# EasyEDA Pro project Pros_touch_weight_sensor-v1.0.0-2023-4-8.eprj, board PWS2
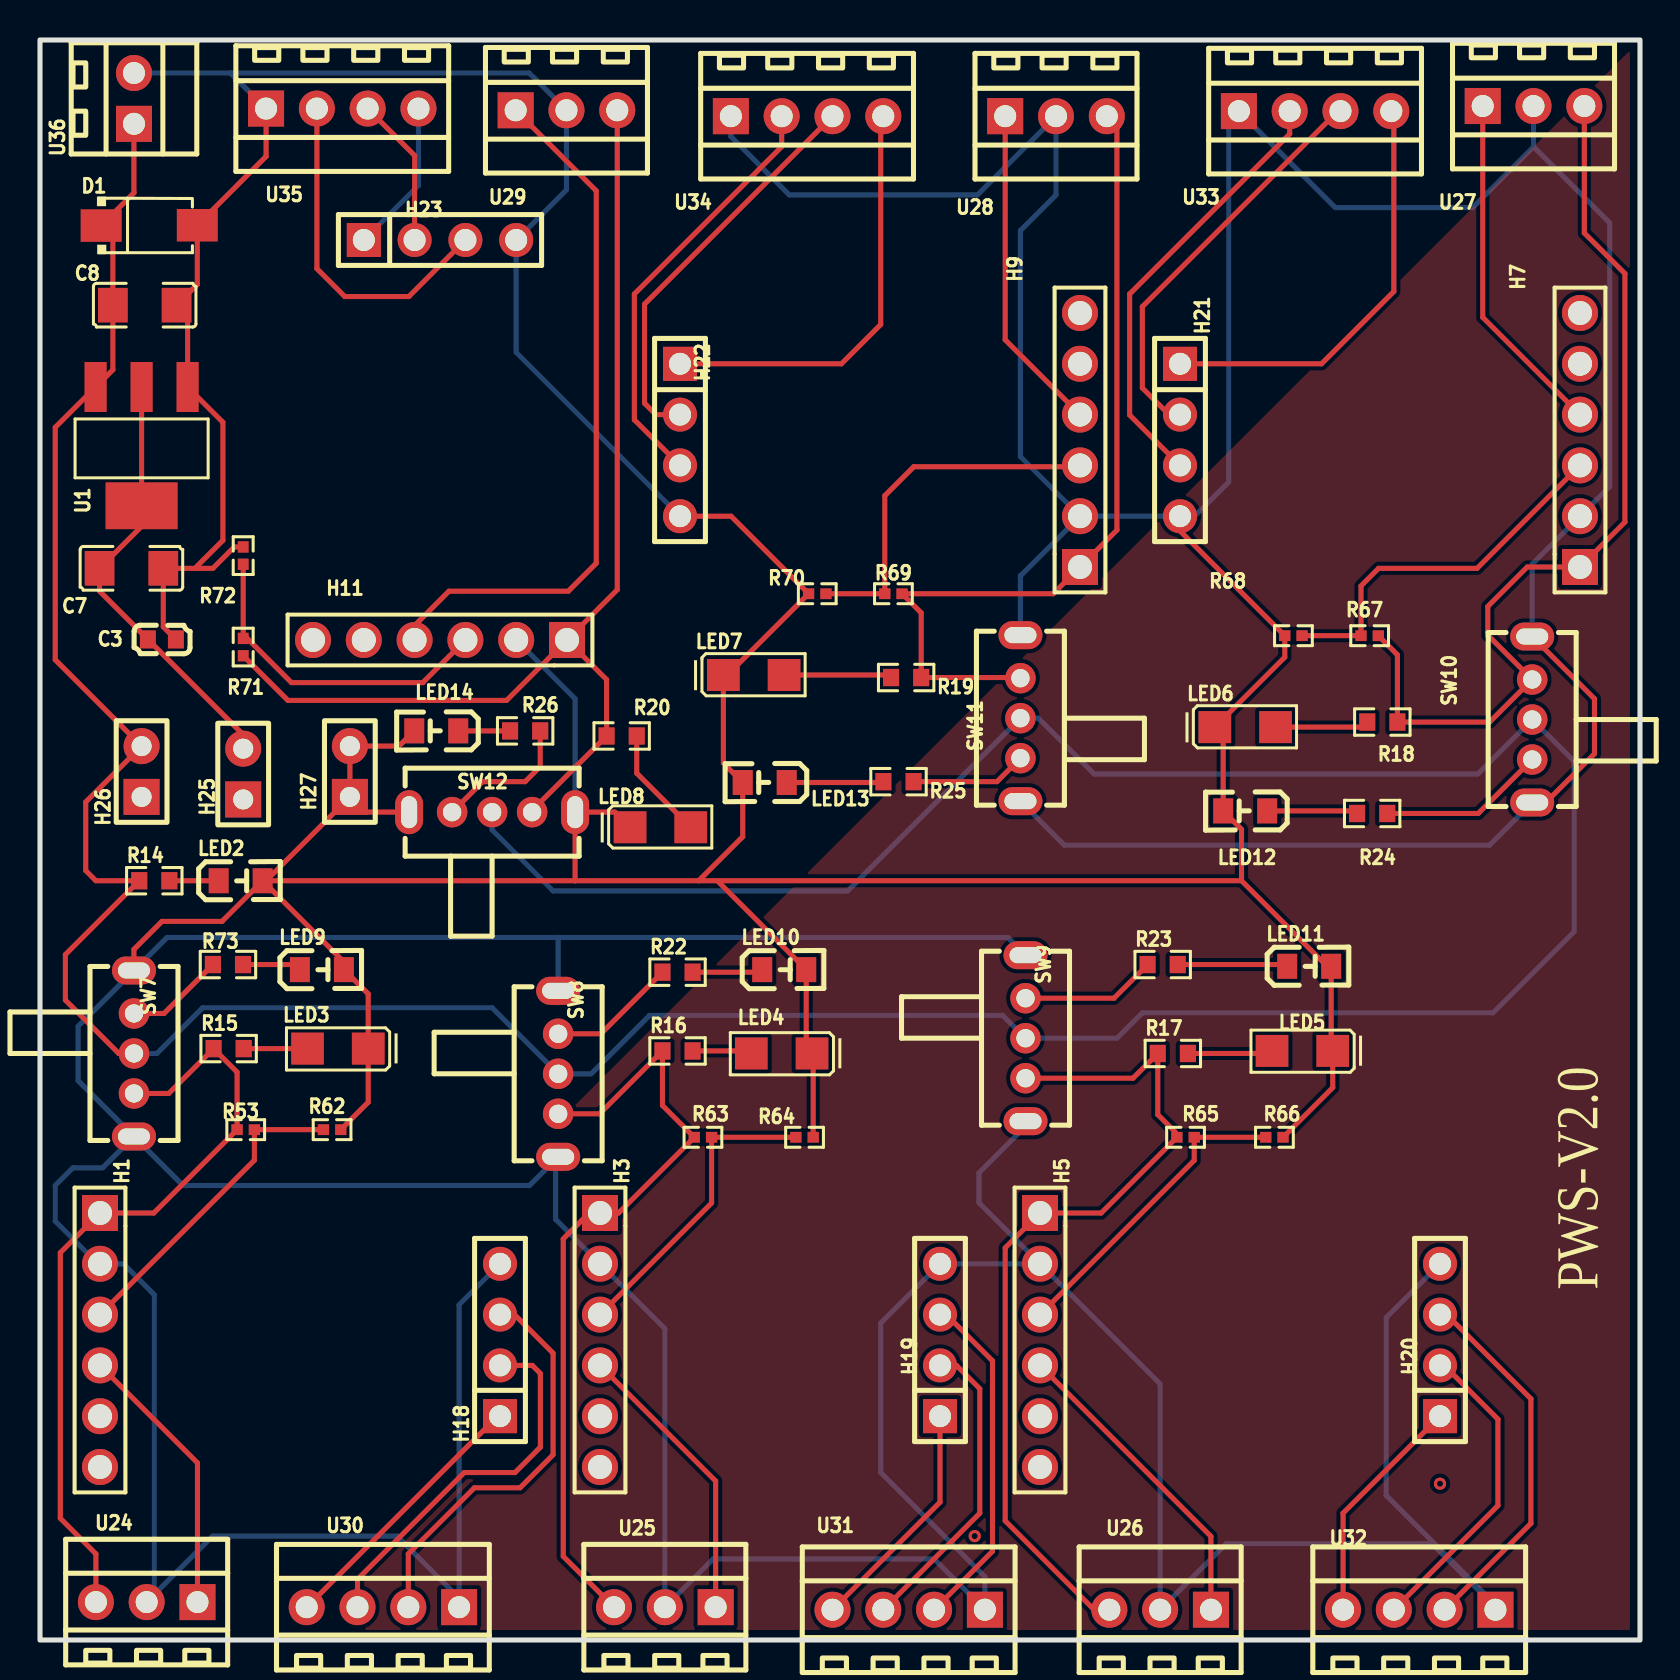
[diagram p5: board, top side]
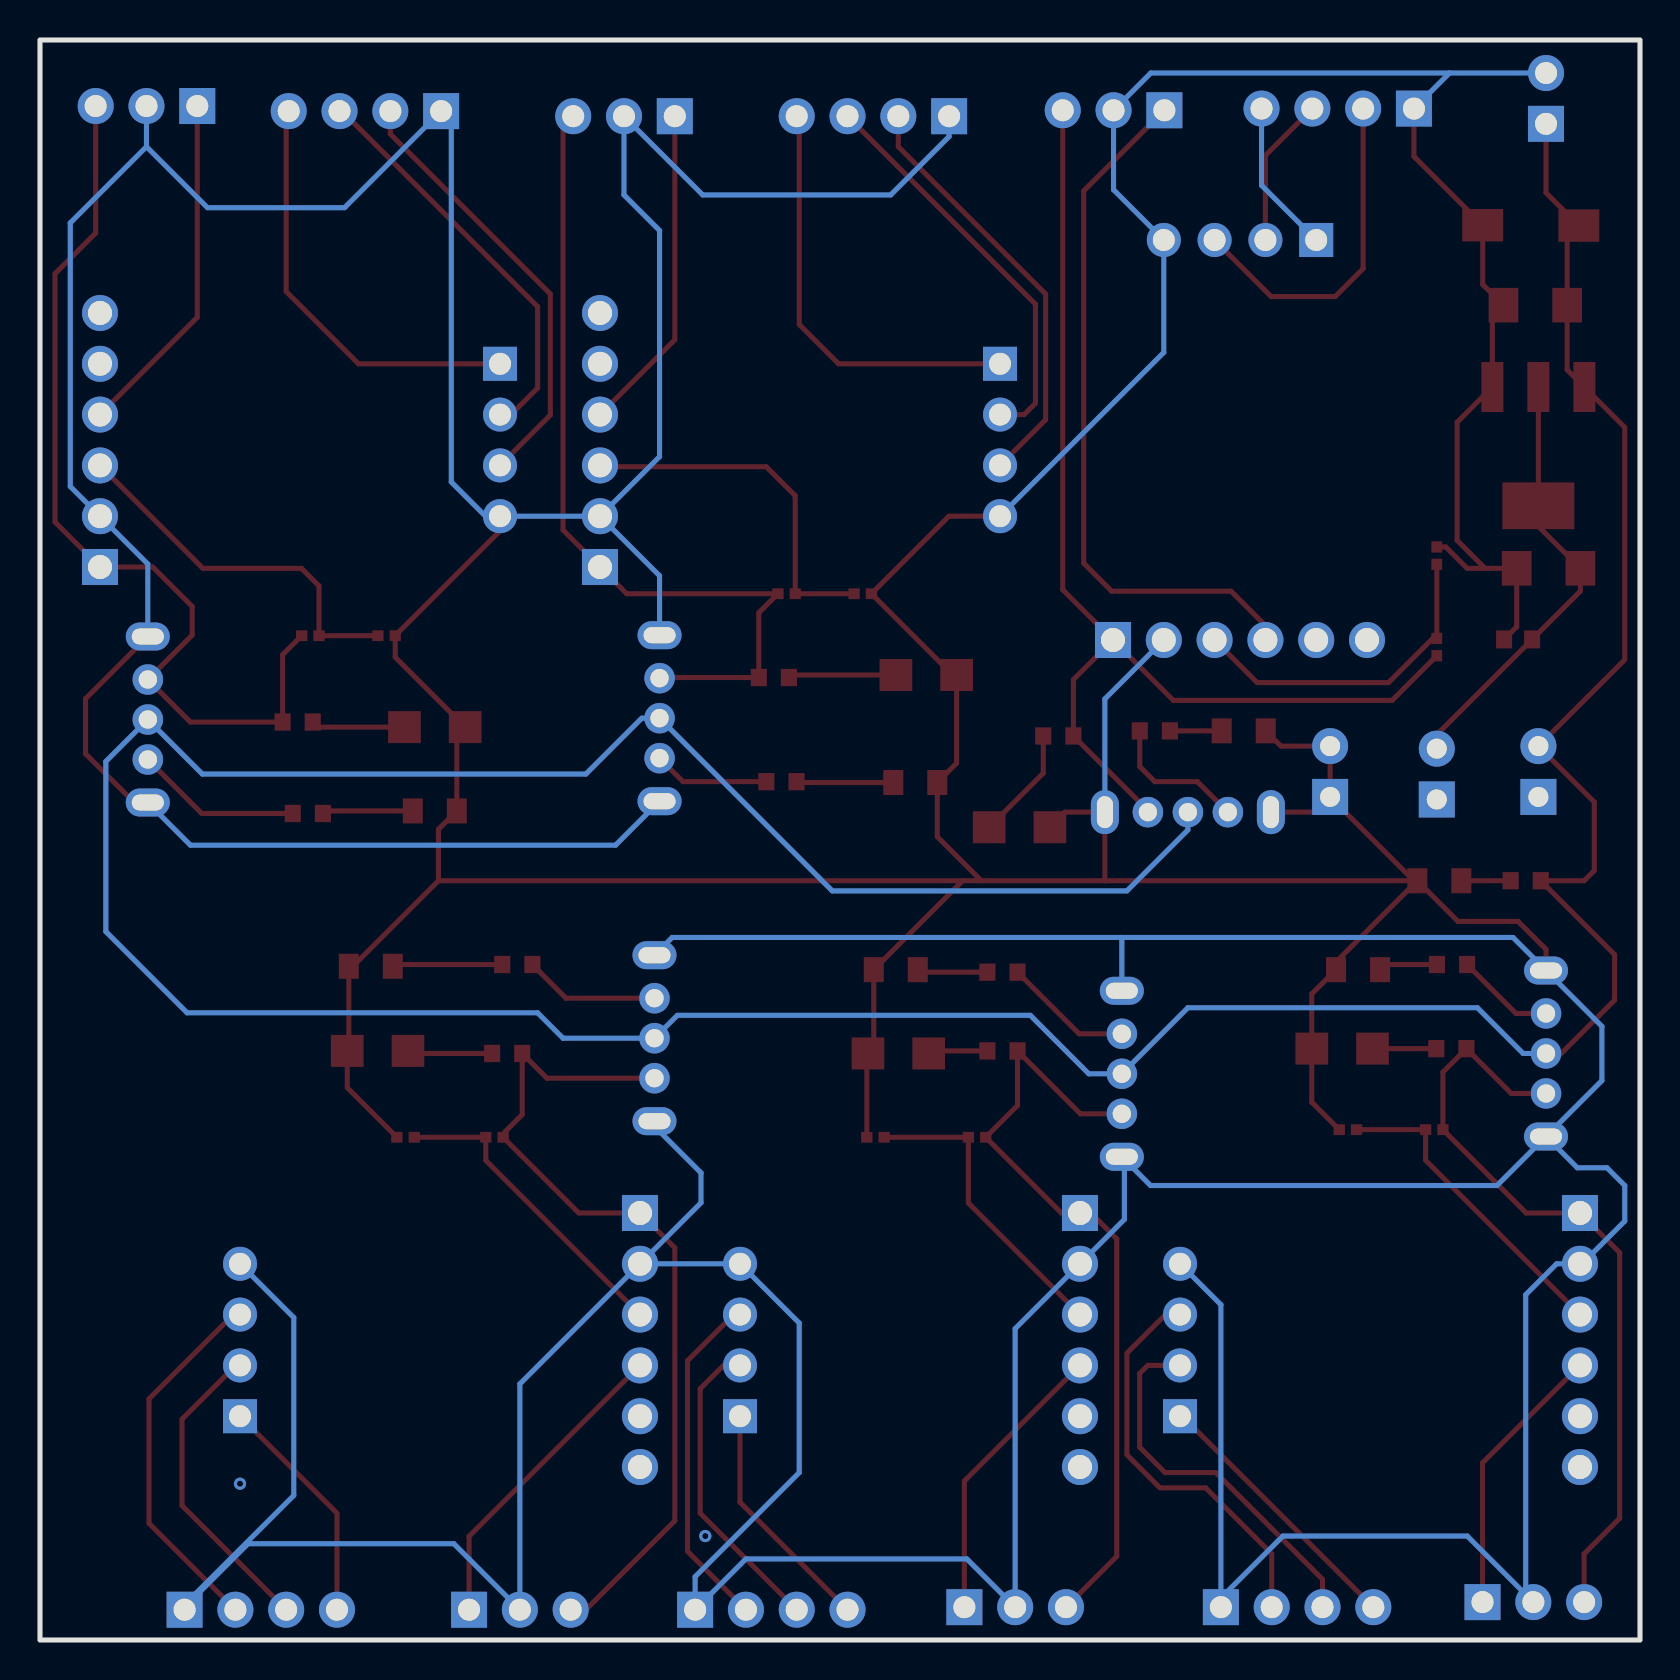
[diagram p6: board, bottom side, seen from below]

Outline 80 x 80 mm; copper layers: Top Layer, Bottom Layer. Coordinates in mm from the lower left corner of the outline.
Outline path: rectangle 0,80 80,0
Stack: Top Layer 0.035mm / Dielectric1 1.51mm FR4 er 4.5 / Bottom Layer 0.035mm

## Design rules (mm)
template: JLCPCB Capability(Two Layers Board)
spacing copperThickness1oz (default): track to track 0.102, other pairs 0.152 to 0.3
spacing copperThickness2oz: track to track 0.203, other pairs 0.152 to 0.3
track width copperThickness1oz (default): min 0.127, default 0.254, max 2.54
track width copperThickness2oz: min 0.203, default 0.254, max 2.54
differential pair differentialPair (default): width min 0.127, default 0.254, max 2.54; gap min 0.152, default 0.152
via viaSize (default): diameter min 0.5, default 0.61, max 10; hole min 0.3, default 0.305, max 6.3

## Placement (name value [footprint] x y rotation side)
C3  100nF  [C0603]  6.1 50.03 180 top
C7  GRM31CC80J476KE01L  [C1206]  4.57 53.58 180 top
C8  GRM31CC80J476KE01L  [C1206]  5.23 66.74 180 top
D1  SMAJ5.0A  [SMA_L4.3-W2.6-LS5.0-RD]  5.46 70.73 0 top
H1  2.54-1x6P直针  [HDR-TH_6P-P2.54-V-M-1]  3 15 270 top
H3  2.54-1x6P直针  [HDR-TH_6P-P2.54-V-M-1]  28 15 270 top
H5  2.54-1x6P直针  [HDR-TH_6P-P2.54-V-M-1]  50 15 270 top
H7  2.54-1x6P直针  [HDR-TH_6P-P2.54-V-M-1]  77 60 90 top
H9  2.54-1x6P直针  [HDR-TH_6P-P2.54-V-M-1]  52 60 90 top
H11  2.54-1x6P直针  [HDR-TH_6P-P2.54-V-M-1]  20 50 180 top
H18  PZ254V-11-04P  [HDR-TH_4P-P2.54-V-M]  23 15 90 top
H19  PZ254V-11-04P  [HDR-TH_4P-P2.54-V-M]  45 15 90 top
H20  PZ254V-11-04P  [HDR-TH_4P-P2.54-V-M]  70 15 90 top
H21  PZ254V-11-04P  [HDR-TH_4P-P2.54-V-M]  57 60 270 top
H22  PZ254V-11-04P  [HDR-TH_4P-P2.54-V-M]  32 60 270 top
H23  PZ254V-11-04P  [HDR-TH_4P-P2.54-V-M]  20 70 0 top
H25  B-2100S02P-A110  [HDR-TH_2P-P2.54-V-M-1]  10.16 43.3 90 top
H26  B-2100S02P-A110  [HDR-TH_2P-P2.54-V-M-1]  5.08 43.42 90 top
H27  B-2100S02P-A110  [HDR-TH_2P-P2.54-V-M-1]  15.49 43.42 90 top
LED2  NCD0805B2  [LED0805-RD]  10.03 37.96 0 top
LED3  NCD1206G1  [LED1206-RD]  14.89 29.57 180 top
LED4  NCD1206G1  [LED1206-RD]  37.08 29.33 180 top
LED5  NCD1206G1  [LED1206-RD]  63.12 29.45 180 top
LED6  NCD1206G1  [LED1206-RD]  60.26 45.64 0 top
LED7  NCD1206G1  [LED1206-RD]  35.69 48.25 0 top
LED8  NCD1206G1  [LED1206-RD]  31.02 40.64 0 top
LED9  NCD0805B2  [LED0805-RD]  14.1 33.52 0 top
LED10  NCD0805B2  [LED0805-RD]  37.21 33.52 0 top
LED11  NCD0805B2  [LED0805-RD]  63.46 33.69 0 top
LED12  NCD0805B2  [LED0805-RD]  60.26 41.45 180 top
LED13  NCD0805B2  [LED0805-RD]  36.24 42.88 180 top
LED14  NCD0805B2  [LED0805-RD]  19.81 45.46 180 top
R14  1kΩ  [R0603]  5.72 37.96 0 top
R15  1kΩ  [R0603]  9.43 29.57 0 top
R16  1kΩ  [R0603]  31.88 29.45 0 top
R17  1kΩ  [R0603]  56.64 29.33 0 top
R18  1kΩ  [R0603]  67.12 45.9 180 top
R19  1kΩ  [R0603]  43.31 48.12 180 top
R20  1kΩ  [R0603]  29.08 45.2 0 top
R22  1kΩ  [R0603]  31.88 33.39 0 top
R23  1kΩ  [R0603]  56.13 33.77 0 top
R24  1kΩ  [R0603]  66.61 41.33 180 top
R25  1kΩ  [R0603]  42.93 42.92 180 top
R26  1kΩ  [R0603]  24.26 45.46 180 top
R53  1kΩ  [R0402]  10.29 25.52 0 top
R62  1kΩ  [R0402]  14.61 25.52 180 top
R63  1kΩ  [R0402]  33.15 25.14 180 top
R64  1kΩ  [R0402]  38.23 25.14 180 top
R65  1kΩ  [R0402]  57.28 25.14 180 top
R66  1kΩ  [R0402]  61.72 25.14 180 top
R67  1kΩ  [R0402]  66.48 50.22 0 top
R68  1kΩ  [R0402]  62.67 50.22 0 top
R69  1kΩ  [R0402]  42.67 52.31 0 top
R70  1kΩ  [R0402]  38.86 52.31 0 top
R71  1kΩ  [R0402]  10.16 49.65 270 top
R72  1kΩ  [R0402]  10.16 54.22 270 top
R73  1kΩ  [R0603]  9.4 33.77 0 top
SW7  SK12D07VG4  [SW-TH_SK12D07VG4]  4.7 29.33 270 top
SW8  SK12D07VG4  [SW-TH_SK12D07VG4]  25.91 28.31 270 top
SW9  SK12D07VG4  [SW-TH_SK12D07VG4]  49.28 30.09 270 top
SW10  SK12D07VG4  [SW-TH_SK12D07VG4]  74.61 46.02 90 top
SW11  SK12D07VG4  [SW-TH_SK12D07VG4]  49.02 46.09 90 top
SW12  SK12D07VG4  [SW-TH_SK12D07VG4]  22.61 41.39 0 top
U1  AMS1117-3.3  [SOT-223-3_L6.5-W3.4-P2.30-LS7.0-BR]  5.08 59.68 90 top
U24  DB125-2.54-3P-GN-S  [CONN-TH_DB125-2.54-3P-GN]  5.33 1.9 180 top
U25  DB125-2.54-3P-GN-S  [CONN-TH_DB125-2.54-3P-GN]  31.24 1.64 180 top
U26  DB125-2.54-3P-GN-S  [CONN-TH_DB125-2.54-3P-GN]  56.01 1.51 180 top
U27  DB125-2.54-3P-GN-S  [CONN-TH_DB125-2.54-3P-GN]  74.68 76.7 0 top
U28  DB125-2.54-3P-GN-S  [CONN-TH_DB125-2.54-3P-GN]  50.8 76.19 0 top
U29  DB125-2.54-3P-GN-S  [CONN-TH_DB125-2.54-3P-GN]  26.32 76.49 0 top
U30  DB125-2.54-4P-GN-S  [CONN-TH_DB125-2.54-4P-GN]  17.14 1.64 180 top
U31  DB125-2.54-4P-GN-S  [CONN-TH_DB125-2.54-4P-GN]  43.43 1.51 180 top
U32  DB125-2.54-4P-GN-S  [CONN-TH_DB125-2.54-4P-GN]  68.96 1.51 180 top
U33  DB125-2.54-4P-GN-S  [CONN-TH_DB125-2.54-4P-GN]  63.75 76.44 0 top
U34  DB125-2.54-4P-GN-S  [CONN-TH_DB125-2.54-4P-GN]  38.35 76.19 0 top
U35  DB125-2.54-4P-GN-S  [CONN-TH_DB125-2.54-4P-GN]  15.11 76.57 0 top
U36  DB125-2.54-2P-GN-S  [CONN-TH_DB125-2.54-2P-GN]  4.7 77.08 90 top

## Footprints (pads in the part's own frame, mm; a bottom-side part is the same pattern mirrored in y, then rotated)
C0603
  rect 0.8x0.9 smd: 1(-0.7,0) 2(0.7,0)
C1206
  rect 1.485x1.728 smd: 1(-1.593,0) 2(1.593,0)
CONN-TH_DB125-2.54-2P-GN
  rect 1.8x1.8 hole 1.1: 1(-1.27,0)
  round 1.8 hole 1.1: 2(1.27,0)
CONN-TH_DB125-2.54-3P-GN
  rect 1.8x1.8 hole 1.1: 1(-2.54,0)
  round 1.8 hole 1.1: 2(0,0) 3(2.54,0)
CONN-TH_DB125-2.54-4P-GN
  rect 1.8x1.8 hole 1.1: 1(-3.81,0)
  round 1.8 hole 1.1: 2(-1.27,0) 3(1.27,0) 4(3.81,0)
HDR-TH_2P-P2.54-V-M-1
  rect 1.8x1.8 hole 1: 1(-1.27,0)
  round 1.8 hole 1: 2(1.27,0)
HDR-TH_4P-P2.54-V-M
  rect 1.7x1.7 hole 1.1: 1(-3.81,0)
  round 1.7 hole 1.1: 2(-1.27,0) 3(1.27,0) 4(3.81,0)
HDR-TH_6P-P2.54-V-M-1
  rect 1.8x1.8 hole 1.2: 1(-6.35,0)
  round 1.8 hole 1.2: 2(-3.81,0) 3(-1.27,0) 4(1.27,0) 5(3.81,0) 6(6.35,0)
LED0805-RD
  rect 1x1.25 smd: 1(-1.1,0) 2(1.1,0)
LED1206-RD
  rect 1.635x1.6 smd: 1(-1.518,0) 2(1.518,0)
R0402
  rect 0.566x0.54 smd: 1(-0.433,0) 2(0.433,0)
R0603
  rect 0.806x0.864 smd: 1(-0.753,0) 2(0.753,0)
SMA_L4.3-W2.6-LS5.0-RD
  rect 2.046x1.62 smd: 1(-2.404,-0.009) 2(2.404,0.009)
SOT-223-3_L6.5-W3.4-P2.30-LS7.0-BR
  rect 2.5x1.1 smd: 1(2.97,-2.3) 2(2.97,0) 3(2.97,2.3)
  rect 2.34x3.6 smd: 4(-2.97,0)
SW-TH_SK12D07VG4
  round 1.524 hole 0.914: 1(-2,0) 2(0,0) 3(2,0)
  oval 1.4x2.2 hole 0.8x1.6: 4(4.15,0) 5(-4.15,0)

## Nets
As in the schematic.

Pads without a net: H1 5 6; H3 5 6; H5 5 6; H7 5 6; H9 5 6; H11 5 6; H25 1; H26 1

## Via types
v1: diameter 0.61, hole 0.305, Top Layer to Bottom Layer, 2 vias

## Routing (per net, layer and track width the routed paths; a pad name or vN(x,y) marks a point on that pad's centre or on a via; arc(x,y) is an arc through that point)
3.3V: length 21.9
  Top Layer w0.254: H25.2 10.16,45.26 C3.2 2.98,52.44 C7.2 5.08,55.68 U1.4 U1.2
5V: length 207
  Top Layer w0.254: U36.1 4.7,72.36 D1.1 3.64,70.13 C8.2 3.64,63.51 U1.3 0.76,60.63 0.76,49.01 H26.2 2.29,41.9 2.29,38.47 2.79,37.96 R14.1 1.27,34.27 1.27,31.99 3.94,29.33 SW7.2
  Bottom Layer w0.254: SW7.2 5.84,29.33 8.13,31.61 22.61,31.61 SW8.2 27.56,28.31 30.48,31.23 48.13,31.23 SW9.2 53.85,30.09 55.12,31.36 72.64,31.36 76.71,35.42 76.71,43.93 SW10.2 71.88,43.3 52.71,43.3 49.91,46.09 SW11.2 40.39,37.45 25.65,37.45 22.61,40.5 SW12.2
GND: length 713.5
  Top Layer w0.254: SW7.5 4.7,34.53 6.1,35.93 9.1,35.93 LED2.2 ; SW10.4 77.72,47.06 77.72,44.31 75.29,41.87 SW10.5 ; 7.75,53.58 C7.1 6.16,50.66 C3.1 ; 7.75,53.58 9.14,54.98 9.14,60.89 U1.1 7.38,66.19 C8.1 7.86,67.78 D1.2 11.3,74.18 U35.1 ; 7.75,53.58 8.64,53.58 9.71,54.65 R72.1 ; H21.4 57,55.45 R68.1 62.24,49.14 LED6.1 59.16,45.23 LED12.2 60.08,40.53 60.08,37.96 ; 32.93,37.96 33.87,37.96 ; 32.93,37.96 35.14,40.17 LED13.2 34.17,43.84 LED7.1 34.37,48.25 R70.1 34.55,56.19 H22.4 ; 32.93,37.96 26.76,37.96 ; 33.87,37.96 60.08,37.96 ; 33.87,37.96 LED10.2 38.31,29.62 LED4.1 38.66,29.27 R64.1 ; H27.1 11.3,37.96 ; H27.1 16.26,41.39 SW12.5 ; H27.1 H27.2 17.95,44.69 LED14.2 ; 11.3,37.96 26.76,37.96 ; 11.3,37.96 LED2.2 ; 60.08,37.96 64.35,33.69 LED11.2 64.56,29.53 LED5.1 64.64,27.62 R66.1 ; LED8.1 28.75,41.39 SW12.4 26.76,37.97 26.76,37.96 ; LED2.2 15.2,33.9 LED9.2 16.41,32.3 LED3.1 16.41,26.89 R62.1
  Bottom Layer w0.254: 25.94,35.13 6.35,35.13 SW7.5 1.91,30.68 1.91,27.97 SW7.4 ; 25.94,35.13 48.39,35.13 SW9.5 ; 25.94,35.13 25.91,35.1 25.91,32.46 ; H9.2 H21.4 57.72,56.19 59.44,57.9 59.44,75.94 U33.1 64.77,71.62 71.63,71.62 74.68,74.67 ; H9.2 49.02,53.21 SW11.4 ; H9.2 49.02,59.17 49.02,70.47 50.8,72.25 U28.2 46.86,72.25 37.47,72.25 34.54,75.17 U34.1 ; SW10.4 74.61,53.8 H7.2 78.49,57.68 78.49,70.86 74.68,74.67 ; SW10.5 72.48,39.74 51.22,39.74 SW11.5 ; 20.96,2.1 20.96,1.64 ; 20.96,2.1 17.85,5.2 8.64,5.2 5.72,2.28 ; 20.96,2.1 20.96,16.76 H18.4 ; 72.77,1.64 U32.1 ; 72.77,1.64 72.77,1.77 67.31,7.23 67.31,16.12 H20.4 ; 72.77,1.64 69.6,4.82 59.31,4.82 U26.2 56.01,12.8 H5.2 ; 25.78,24.03 25.78,21.03 H3.2 31.24,15.57 U25.2 33.66,4.05 44.7,4.05 U31.1 47.24,3.16 42.04,8.37 42.04,15.85 H19.4 H5.2 ; 25.78,24.03 SW8.4 ; 25.78,24.03 24.47,22.72 7.15,22.72 SW7.4 ; H5.2 46.95,21.86 46.95,23.36 49.15,25.56 ; SW12.4 26.76,47.05 H11.2 ; 74.68,74.67 U27.2 ; 5.72,2.28 5.72,17.26 4.17,18.81 H1.2 2.9,18.81 0.76,20.94 0.76,22.72 1.65,23.61 3.13,23.61 SW7.4 ; 5.72,2.28 U24.2 ; 9.53,78.35 24.46,78.35 U29.2 26.32,72.51 H23.4 23.81,64.38 H22.4 ; 9.53,78.35 U35.1 ; 9.53,78.35 U36.2
  vias: v1(46.74,5.2) v1(70,7.81)
VCC1: length 13.6
  Top Layer w0.254: H18.1 22.88,11.19 U30.4
VCC2: length 11.9
  Top Layer w0.254: U31.4 45,6.89 H19.1
VCC3: length 11.7
  Top Layer w0.254: U32.4 65.15,6.34 H20.1
VCC4: length 21.3
  Top Layer w0.254: H21.1 64.07,63.81 67.69,67.43 67.69,76.32 U33.4
VCC5: length 21.3
  Top Layer w0.254: H22.1 40.07,63.81 42.04,65.78 42.04,76.06 U34.4
VCC6: length 7.7
  Bottom Layer w0.254: H23.1 18.92,72.73 U35.4
A1+: length 13.9
  Top Layer w0.254: U24.1 7.87,8.86 H1.4
A1-: length 15.9
  Top Layer w0.254: H1.3 10.72,23.99 R53.2 R62.2
A2+: length 14.5
  Top Layer w0.254: U25.1 33.78,7.95 H3.4
A2-: length 15.4
  Top Layer w0.254: R64.2 R63.1 33.58,21.85 H3.3
A3+: length 15.8
  Top Layer w0.254: U26.1 58.55,5.18 H5.4
A3-: length 15.8
  Top Layer w0.254: H5.3 57.71,23.98 R65.1 61.29,25.14 61.42,25.01
A4+: length 17.4
  Top Layer w0.254: H7.4 72.14,66.13 U27.1
A4-: length 18.9
  Top Layer w0.254: R68.2 66.05,50.22 66.05,52.7 66.93,53.58 71.85,53.58 H7.3
A5+: length 16.5
  Top Layer w0.254: H9.4 48.26,65.01 U28.1
A5-: length 18.2
  Top Layer w0.254: H9.3 51.93,58.66 43.69,58.66 42.24,57.22 R69.1 R70.2
A6+: length 35.4
  Top Layer w0.254: U29.1 27.81,72.46 27.81,53.84 26.42,52.44 20.45,52.44 18.73,50.72 H11.4
A6-: length 16.6
  Top Layer w0.254: H11.3 19.14,47.87 12.57,47.87 10.36,50.08 R71.1 R72.2
DT: length 20.5
  Top Layer w0.254: U30.2 18.41,4.31 21.72,7.61 24,7.61 25.65,9.26 25.65,14.34 23.72,16.27 H18.3
DT2: length 17.2
  Top Layer w0.254: U31.2 47.62,4.44 47.62,13.96 45.31,16.27 H19.3
DT3: length 18.6
  Top Layer w0.254: U32.2 74.55,5.83 74.55,12.06 70.33,16.27 H20.3
DT4: length 22.1
  Top Layer w0.254: H21.3 54.48,61.25 54.48,67.3 62.48,75.3 U33.2
DT5: length 21.5
  Top Layer w0.254: U34.2 37.08,74.67 29.72,67.3 29.72,61.01 H22.3
DT6: length 17.2
  Top Layer w0.254: H23.3 18.44,67.17 15.24,67.17 13.84,68.57 U35.2
E1+: length 39
  Top Layer w0.254: U24.3 2.79,4.31 1.02,6.09 1.02,19.37 H1.1 5.69,21.35 R53.1 9.85,28.39 R15.1 6.44,27.33 SW7.3
E2+: length 39.6
  Top Layer w0.254: SW8.3 27.98,26.31 R16.1 31.12,26.73 R63.2 28.93,21.35 H3.1 27.46,21.35 26.16,20.06 26.16,4.18 U25.3
E3+: length 43
  Top Layer w0.254: U26.3 52.71,1.51 48.26,5.96 48.26,19.61 H5.1 53.06,21.35 R65.2 ; 56.77,25.39 55.89,26.27 R17.1 54.65,28.09 SW9.3
E4+: length 47.2
  Top Layer w0.254: R67.2 67.87,49.26 R18.1 72.48,45.9 SW10.3 72.39,50.24 72.39,51.68 74.36,53.65 H7.1 79.25,55.9 79.25,68.32 77.22,70.35 U27.3
E5+: length 42.5
  Top Layer w0.254: U28.3 53.85,75.68 53.85,55.5 H9.1 50.66,52.31 R69.2 44.06,51.36 R19.1 48.99,48.12 SW11.3
E6+: length 56.9
  Top Layer w0.254: H11.1 23.33,46.98 12.39,46.98 R71.2 ; H11.1 28.86,52.51 U29.3 ; H11.1 28.33,48.02 R20.1 24.61,41.48 SW12.3
SCK: length 19.1
  Top Layer w0.254: U30.3 15.88,3.04 21.21,8.37 23.75,8.37 25.02,9.64 25.02,13.32 24.61,13.73 H18.2
SCK2: length 15.5
  Top Layer w0.254: U31.3 46.99,6.34 46.99,12.56 45.82,13.73 H19.2
SCK3: length 15.7
  Top Layer w0.254: U32.3 72.9,6.72 72.9,11.04 70.21,13.73 H20.2
SCK4: length 20.5
  Top Layer w0.254: U33.3 64.9,76.44 55.12,66.67 55.12,62.6 56.45,61.27 H21.2
SCK5: length 20.3
  Top Layer w0.254: U34.3 30.23,66.79 30.23,61.84 30.79,61.27 H22.2
SCK6: length 7.5
  Top Layer w0.254: U35.3 18.73,74.22 H23.2
$1N6996: length 2.5
  Top Layer w0.254: 8.93,38.09 8.81,37.96 R14.2
$1N8106: length 3
  Top Layer w0.254: R16.2 35.44,29.45 LED4.2
$1N8147: length 4.3
  Top Layer w0.254: LED5.2 61.47,29.33 R17.2
$1N8185: length 4.7
  Top Layer w0.254: LED6.2 66.11,45.64 R18.2
$1N8223: length 5.4
  Top Layer w0.254: LED7.2 42.43,48.25 R19.2
$1N8261: length 5.7
  Top Layer w0.254: R20.2 29.84,43.34 LED8.2
$1N8986: length 3.5
  Top Layer w0.254: R22.2 35.98,33.39 LED10.1
$1N9065: length 5.5
  Top Layer w0.254: LED11.1 62.27,33.77 R23.2
$1N9144: length 4.5
  Top Layer w0.254: R24.2 65.73,41.45 61.36,41.45
$1N9223: length 4.9
  Top Layer w0.254: LED13.1 42.13,42.88 R25.2
$1N9302: length 2.6
  Top Layer w0.254: R26.2 LED14.1
$1N21279: length 5
  Top Layer w0.254: SW7.1 6.2,31.33 R73.1
$1N21286: length 6.5
  Top Layer w0.254: R22.1 28.04,30.31 SW8.1
$1N21297: length 6.8
  Top Layer w0.254: R23.1 53.7,32.09 SW9.1
$1N21310: length 8.4
  Top Layer w0.254: R24.1 71.91,41.33 SW10.1
$1N21323: length 5.8
  Top Layer w0.254: R25.1 47.85,42.92 SW11.1
$1N21338: length 7.1
  Top Layer w0.254: SW12.1 22.13,42.92 24.26,42.92 25.01,43.67 R26.1
$1N24564: length 3.2
  Top Layer w0.254: R15.2 LED3.2
$1N24602: length 3
  Top Layer w0.254: R73.2 12.74,33.77 LED9.1

## Copper pours and planes (outline as drawn; the poured copper is in the pictures)
(no net) on Top Layer: -0.25,-0.26 80.26,-0.26 80.26,80.25

## Text on the board
Top Silkscreen Layer: PWS-V2.0
